# EAGLE design schema Light_system (EAGLE 9.2.0)
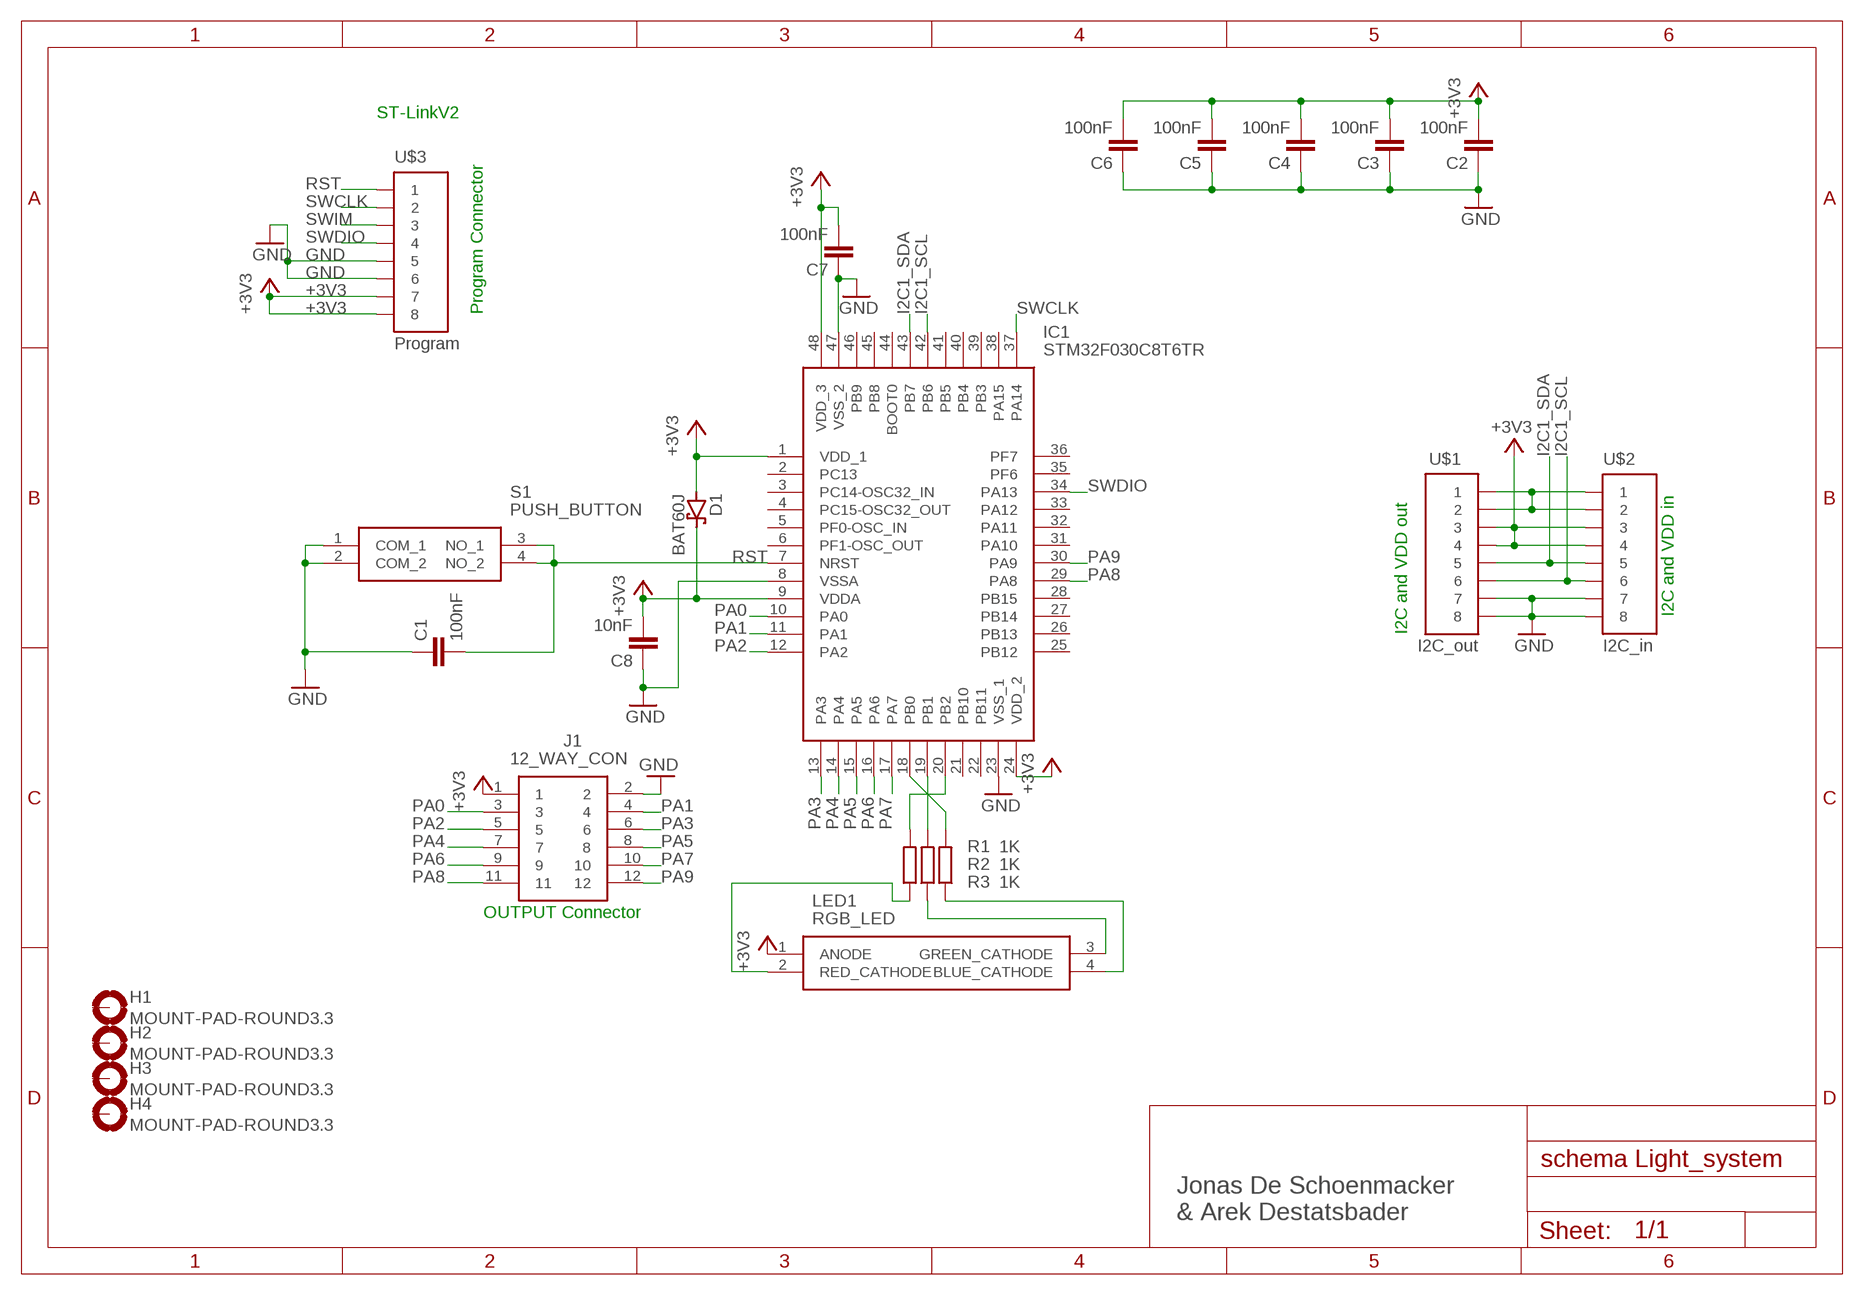
[diagram p0: schematic, sheet 1]

## Parts
C1  100nF  C-EUC1206  [C1206]
C2  100nF  C-EUC1206  [C1206]
C3  100nF  C-EUC1206  [C1206]
C4  100nF  C-EUC1206  [C1206]
C5  100nF  C-EUC1206  [C1206]
C6  100nF  C-EUC1206  [C1206]
C7  100nF  C-EUC1206  [C1206]
C8  10nF  C-EUC1206  [C1206]
D1  BAT60J  [SOD323_ST]
H1  MOUNT-PAD-ROUND3.3  [3,3-PAD]
H2  MOUNT-PAD-ROUND3.3  [3,3-PAD]
H3  MOUNT-PAD-ROUND3.3  [3,3-PAD]
H4  MOUNT-PAD-ROUND3.3  [3,3-PAD]
IC1  STM32F030C8T6TR  [QFP50P900X900X160-48N]
J1  12_WAY_CON  [1990106]
LED1  RGB_LED  [ASMBKTF00A306]
R1  1K  R-EU_R1206  [R1206]
R2  1K  R-EU_R1206  [R1206]
R3  1K  R-EU_R1206  [R1206]
S1  PUSH_BUTTON  [LL3301FF065QJ]
U$1  I2C_out  MODULARCONNECTOR  [MA04-2]
U$2  I2C_in  MODULARCONNECTOR  [MA04-2]
U$3  Program  MODULARCONNECTOR  [MA04-2]

## Nets
+3V3: C2.2 C3.2 C4.2 C5.2 C6.2 C7.2 C8.2 D1.A D1.C IC1.1(VDD_1) IC1.9(VDDA) IC1.24(VDD_2) IC1.48(VDD_3) J1.1 LED1.1(ANODE) U$1.3 U$1.4 U$2.3 U$2.4 U$3.7 U$3.8
GND: C1.1 C2.1 C3.1 C4.1 C5.1 C6.1 C7.1 C8.1 IC1.8(VSSA) IC1.23(VSS_1) IC1.47(VSS_2) J1.2 S1.1(COM_1) S1.2(COM_2) U$1.7 U$1.8 U$2.7 U$2.8 U$3.5 U$3.6
I2C1_SCL: IC1.42(PB6) U$1.6 U$2.6
I2C1_SDA: IC1.43(PB7) U$1.5 U$2.5
N$1: LED1.2(RED_CATHODE) R1.1
N$2: LED1.3(GREEN_CATHODE) R2.1
N$3: IC1.20(PB2) R1.2
N$4: LED1.4(BLUE_CATHODE) R3.1
N$5: U$1.1 U$1.2 U$2.1 U$2.2
N$6: IC1.19(PB1) R2.2
N$7: IC1.18(PB0) R3.2
PA0: IC1.10(PA0) J1.3
PA1: IC1.11(PA1) J1.4
PA2: IC1.12(PA2) J1.5
PA3: IC1.13(PA3) J1.6
PA4: IC1.14(PA4) J1.7
PA5: IC1.15(PA5) J1.8
PA6: IC1.16(PA6) J1.9
PA7: IC1.17(PA7) J1.10
PA8: IC1.29(PA8) J1.11
PA9: IC1.30(PA9) J1.12
RST: C1.2 IC1.7(NRST) S1.3(NO_1) S1.4(NO_2) U$3.1
SWCLK: IC1.37(PA14) U$3.2
SWDIO: IC1.34(PA13) U$3.4
SWIM: U$3.3
Unconnected: H1.B3,3(MOUNT) H2.B3,3(MOUNT) H3.B3,3(MOUNT) H4.B3,3(MOUNT) IC1.2(PC13) IC1.3(PC14-OSC32_IN) IC1.4(PC15-OSC32_OUT) IC1.5(PF0-OSC_IN) IC1.6(PF1-OSC_OUT) IC1.21(PB10) IC1.22(PB11) IC1.25(PB12) IC1.26(PB13) IC1.27(PB14) IC1.28(PB15) IC1.31(PA10) IC1.32(PA11) IC1.33(PA12) IC1.35(PF6) IC1.36(PF7) IC1.38(PA15) IC1.39(PB3) IC1.40(PB4) IC1.41(PB5) IC1.44(BOOT0) IC1.45(PB8) IC1.46(PB9)

## Notes on the sheet
- ST-LinkV2
- Program Connector
- I2C and VDD in
- I2C and VDD out
- OUTPUT Connector
- Jonas De Schoenmacker
  & Arek Destatsbader

## Library data of the parts
C1-C8 = resistor:C-EU: CAPACITOR, European symbol
D1 = diode:BAT60J: Schottky barrier diode Source: www.st.com, BAT60J.pdf
H1-H4 = holes:MOUNT-PAD-ROUND: MOUNTING PAD, round
IC1 = Library light system:STM32F030C8T6TR: 32-Bit MCU Cortex-M0 64K Flash LQFP48 32-Bit MCU Cortex-M0 64K Flash LQFP48 Source: Datasheet <https://componentsearchengine.com/Datasheets/1/STM32F030C8T6TR.pdf>; DESCRIPTION: 32-Bit MCU Cortex-M0 64K Flash LQFP48 32-Bit MCU Cortex-M0 64K Flash LQFP48; HEIGHT: 1.6mm; MANUFACTURER_NAME: STMicroelectronics; MANUFACTURER_PART_NUMBER: STM32F030C8T6TR; MOUSER_PART_NUMBER: 511-STM32F030C8T6TR; MOUSER_PRICE-STOCK: https://www.mouser.com/Search/Refine.aspx?Keyword=511-STM32F030C8T6TR
J1 = Library light system:12_WAY_CON: PTSA 0,5/12-2,5-Z Source: Datasheet <https://componentsearchengine.com/Datasheets/1/1990106.pdf>; DESCRIPTION: PTSA 0,5/12-2,5-Z; HEIGHT: 13.1mm; MANUFACTURER_NAME: Phoenix Contact; MANUFACTURER_PART_NUMBER: 1990106; MOUSER_PART_NUMBER: 651-1990106; MOUSER_PRICE-STOCK: https://www.mouser.com/Search/Refine.aspx?Keyword=651-1990106
LED1 = Library light system:RGB_LED: Standard LEDs - SMD 2220 PLCC4 Tricolor Source: Datasheet <https://componentsearchengine.com/Datasheets/1/ASMB-KTF0-0A306.pdf>; DESCRIPTION: Standard LEDs - SMD 2220 PLCC4 Tricolor; HEIGHT: 2.1mm; MANUFACTURER_NAME: Avago Technologies; MANUFACTURER_PART_NUMBER: ASMB-KTF0-0A306; MOUSER_PART_NUMBER: 630-ASMB-KTF0-0A306; MOUSER_PRICE-STOCK: https://www.mouser.com/Search/Refine.aspx?Keyword=630-ASMB-KTF0-0A306
R1-R3 = rcl:R-EU_: RESISTOR, European symbol; SPICEPREFIX: R
S1 = Library light system:PUSH_BUTTON: Pushbutton Switches 50mA 12VDC F065 7.0mm J-Lead Source: Datasheet <https://componentsearchengine.com/Datasheets/1/LL3301FF065QJ.pdf>; DESCRIPTION: Pushbutton Switches 50mA 12VDC F065 7.0mm J-Lead; HEIGHT: 7.3mm; MANUFACTURER_NAME: E-Switch; MANUFACTURER_PART_NUMBER: LL3301FF065QJ; MOUSER_PART_NUMBER: 612-LL3301FF065QJ; MOUSER_PRICE-STOCK: https://www.mouser.com/Search/Refine.aspx?Keyword=612-LL3301FF065QJ
U$1-U$3 = Main_lib:MODULARCONNECTOR

## Net classes
1 OSC pairs: width 0.305 mm

## Board
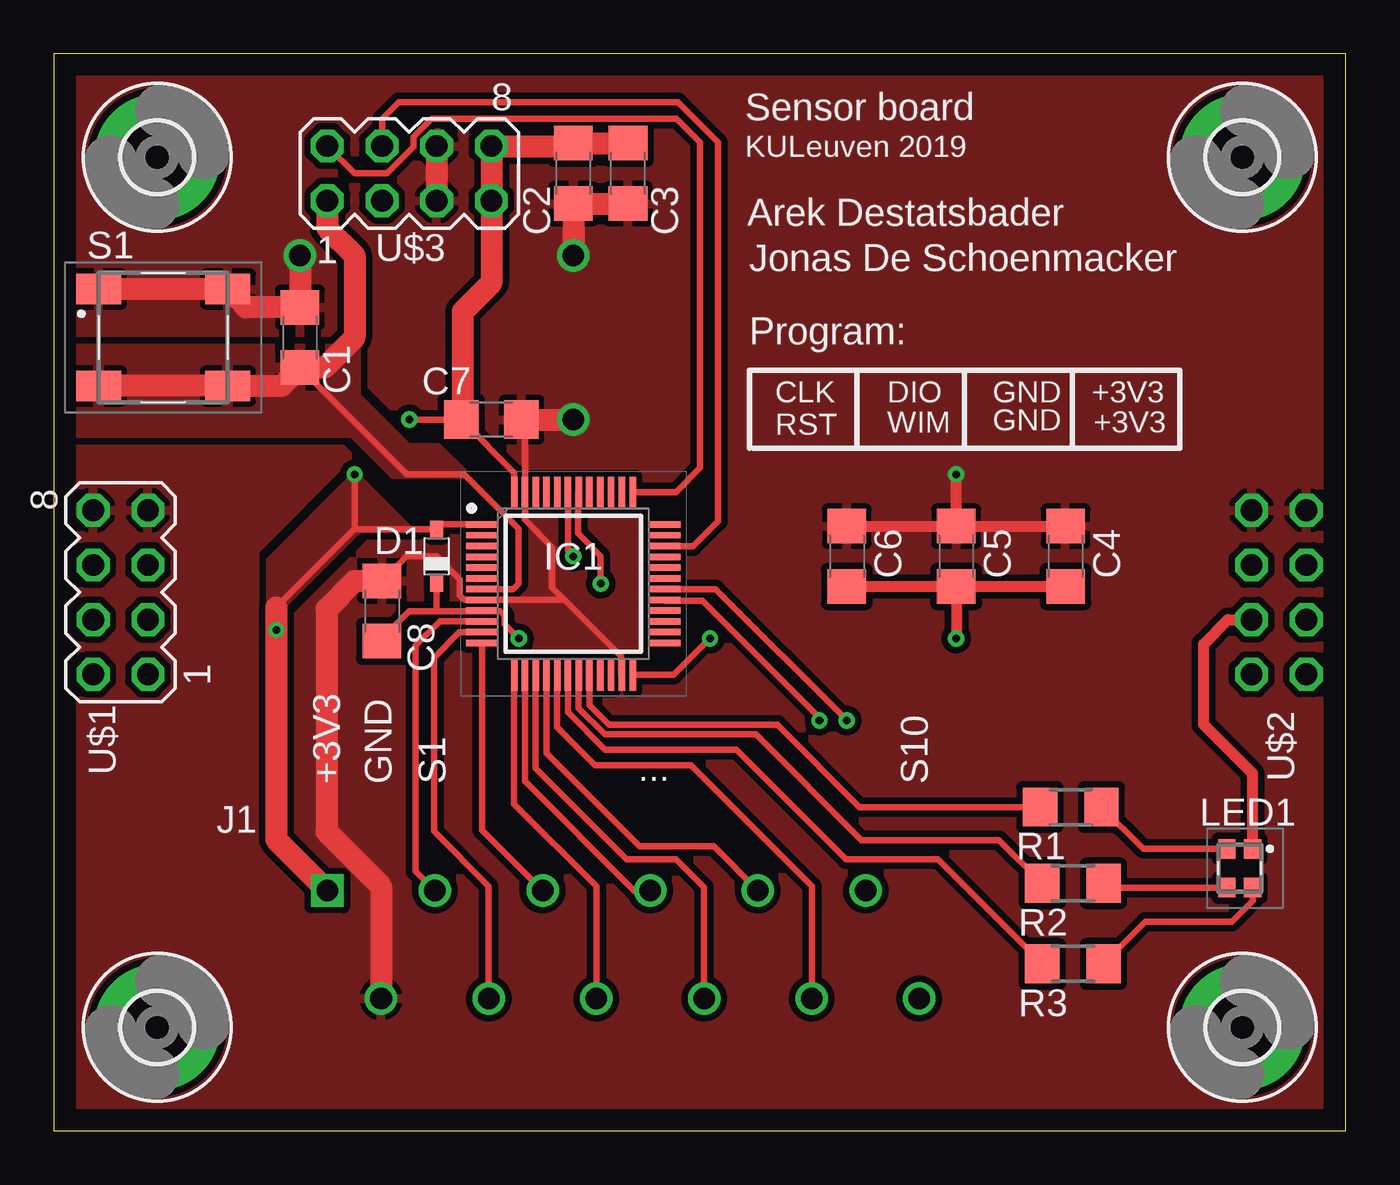
[diagram p1: board, top side]
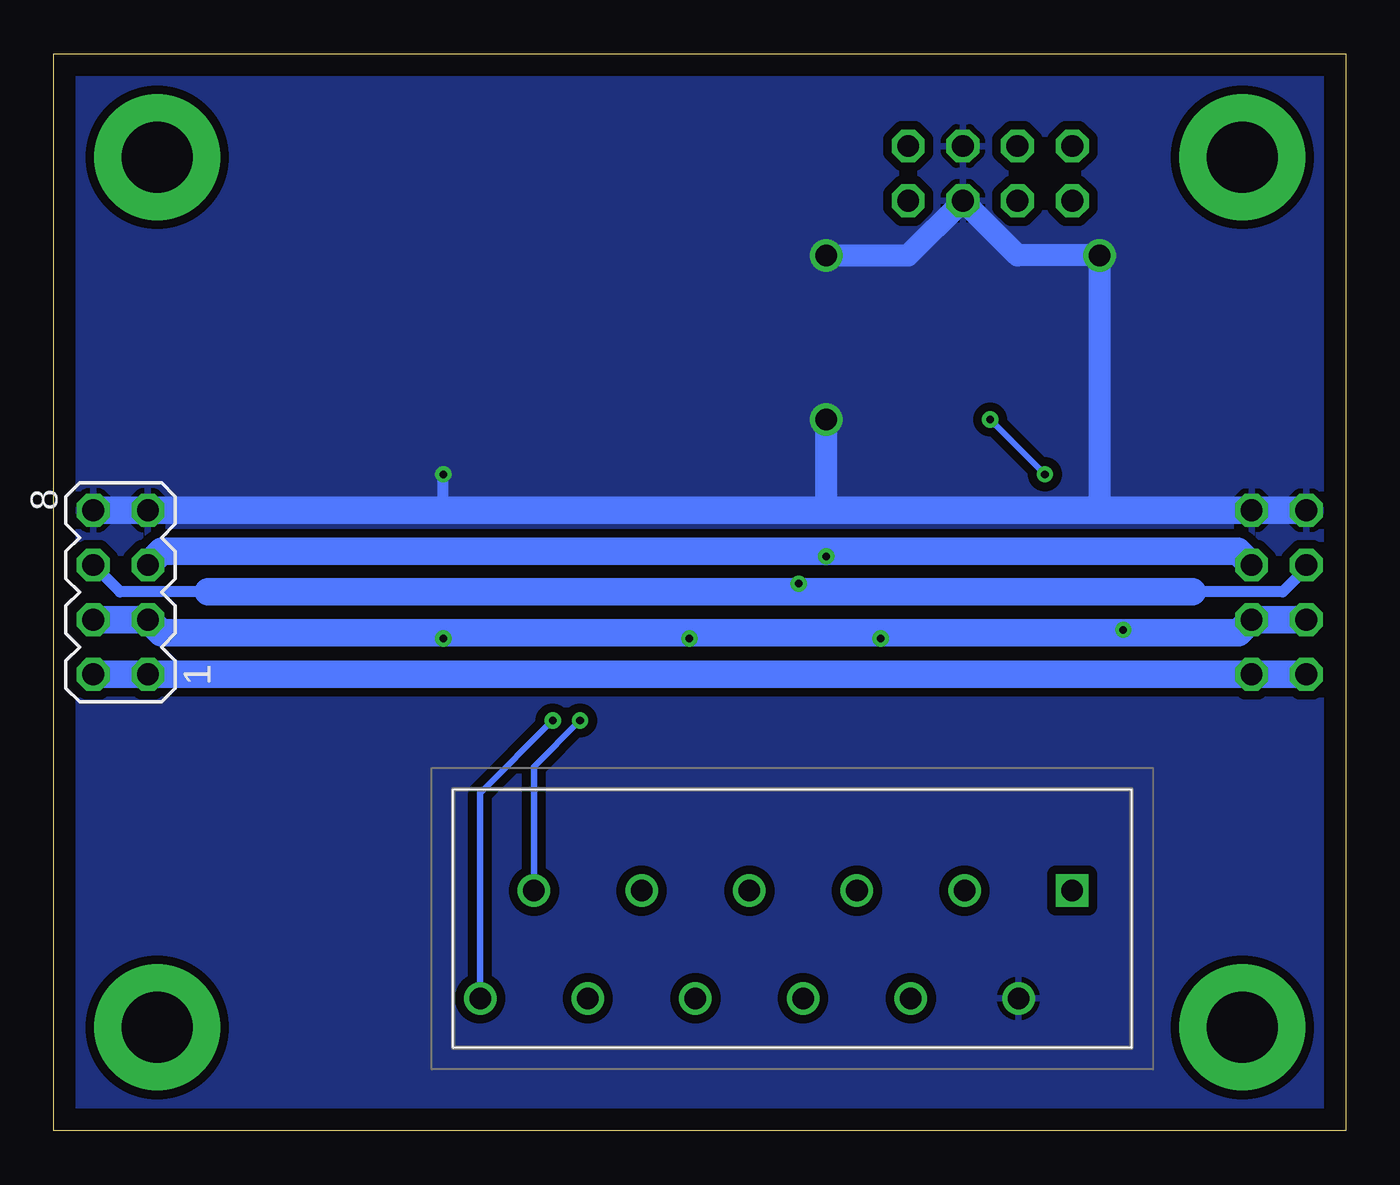
[diagram p2: board, bottom side, seen from below]

Size 60 x 50 mm. Coordinates in mm from the lower left corner, seen from the top.
Outline: 0,0 60,0 60,50 0,50 0,0
Copper layers (1*16): Top 0.035mm / dielectric 1.5mm / Bottom 0.035mm
Design rules "default": minimum track width 6mil, minimum drill 0.35mm, track to track 6mil, track to pad 6mil, pad to pad 6mil, via to via 6mil, smd to smd 6mil, copper to edge 40mil, drill to drill 6mil, minimum pad ring 10mil, minimum via ring 8mil, stop-mask expansion 4mil, vias tented up to drill 0mil, thermal gap 10mil

### Footprints (pad centres in the part's own frame; a part is rotated, then mirrored left to right if it is on the bottom)
C1206 = smd 1.6 x 1.8: 1 -1.4,0; 2 1.4,0
SOD323_ST = smd 0.8 x 0.6: A 1.25,0; C -1.25,0
3,3-PAD = drill 3.3 pad 5.842: B3,3 0,0
QFP50P900X900X160-48N = smd 1.475 x 0.3: 1 -4.238,2.75; 2 -4.238,2.25; 3 -4.238,1.75; 4 -4.238,1.25; 5 -4.238,0.75; 6 -4.238,0.25; 7 -4.238,-0.25; 8 -4.238,-0.75; 9 -4.238,-1.25; 10 -4.238,-1.75; 11 -4.238,-2.25; 12 -4.238,-2.75; 25 4.238,-2.75; 26 4.238,-2.25; 27 4.238,-1.75; 28 4.238,-1.25; 29 4.238,-0.75; 30 4.238,-0.25; 31 4.238,0.25; 32 4.238,0.75; 33 4.238,1.25; 34 4.238,1.75; 35 4.238,2.25; 36 4.238,2.75 | smd 0.3 x 1.475: 13 -2.75,-4.238; 14 -2.25,-4.238; 15 -1.75,-4.238; 16 -1.25,-4.238; 17 -0.75,-4.238; 18 -0.25,-4.238; 19 0.25,-4.238; 20 0.75,-4.238; 21 1.25,-4.238; 22 1.75,-4.238; 23 2.25,-4.238; 24 2.75,-4.238; 37 2.75,4.238; 38 2.25,4.238; 39 1.75,4.238; 40 1.25,4.238; 41 0.75,4.238; 42 0.25,4.238; 43 -0.25,4.238; 44 -0.75,4.238; 45 -1.25,4.238; 46 -1.75,4.238; 47 -2.25,4.238; 48 -2.75,4.238
1990106 = drill 1 pad 1.5 square: 1 0,0 | drill 1 pad 1.5: 2 2.5,5; 3 5,0; 4 7.5,5; 5 10,0; 6 12.5,5; 7 15,0; 8 17.5,5; 9 20,0; 10 22.5,5; 11 25,0; 12 27.5,5
ASMBKTF00A306 = smd 0.9 x 0.8: 1 0.9,-0.6; 2 0.9,0.6; 3 -0.9,0.6; 4 -0.9,-0.6
R1206 = smd 1.6 x 1.803: 1 -1.422,0; 2 1.422,0
LL3301FF065QJ = smd 2.1 x 1.4: 1 -3,2.25; 2 3,2.25; 3 -3,-2.25; 4 3,-2.25
MA04-2 = drill 1.016 octagon: 1 -3.81,-1.27; 2 -3.81,1.27; 3 -1.27,-1.27; 4 -1.27,1.27; 5 1.27,-1.27; 6 1.27,1.27; 7 3.81,-1.27; 8 3.81,1.27

### Placement (x,y rotation side)
C1  11.43,36.83 270 top
C2  24.13,44.45 90 top
C3  26.67,44.45 90 top
C4  46.99,26.67 270 top
C5  41.91,26.67 270 top
C6  36.83,26.67 270 top
C7  20.32,33.02 180 top
C8  15.24,24.13 270 top
D1  17.78,26.67 90 top
H1  4.8,45.2 0 top
H2  55.2,45.2 0 top
H3  4.8,4.8 0 top
H4  55.2,4.8 0 top
IC1  24.13,25.4 0 top
J1  12.7,11.15 180 bottom
LED1  55.08,12.19 90 top
R1  47.23,15.03 180 top
R2  47.33,11.49 180 top
R3  47.33,7.75 180 top
S1  5.08,36.83 0 top
U$1  3.1,25 90 top
U$2  56.9,25 90 bottom
U$3  16.51,44.45 0 top

### Tracks (layer width: path | path; a pad name or v marks a point on that pad's centre or on a via)
+3V3  (via drill 0.35)
  Top 0.152: IC1.9 19.87,24.13 | 15.24,22.86 C8.2 | 13.97,27.94 13.95,27.92
  Top 0.305: IC1.48 21.38,30.56 18.98,32.95 C7.2 v16.51,33.02 | 17.78,24.13 19.87,24.13 20.73,24.13 20.93,23.93 20.93,23.52 v21.59,22.86 | 17.78,24.13 16.51,24.13 15.24,22.86 | 10.33,24.3 13.95,27.92 D1.A 18.01,28.15 IC1.1 | D1.C 17.78,24.13 | v30.48,22.86 28.78,21.16 IC1.24 | v13.97,30.48 13.97,27.94
  Top 0.508: C5.2 v41.91,22.86 | C6.2 C5.2 | C5.2 C4.2 | LED1.1 55.68,16.58 53.4,18.86 53.4,22.6 54.53,23.73 U$2.3
  Top 1.016: 10.33,24.3 v10.33,23.26 10.33,13.52 J1.1 | C3.2 C2.2 24,45.72 U$3.8 U$3.7 20.32,39.37 18.98,38.03 18.98,32.95
  Bottom 0.152: v10.33,23.26 10.18,23.11 8.89,23.11
  Bottom 0.305: v41.91,22.86 42.16,23.11 43.18,23.11 | v30.48,22.86 30.48,23.11 | v21.59,22.86 21.84,23.11 22.86,23.11 | v13.97,30.48 v16.51,33.02
  Bottom 1.27: U$2.4 U$2.3 55.01,23.11 43.18,23.11 30.48,23.11 22.86,23.11 8.89,23.11 4.99,23.11 U$1.3 U$1.4
  pour Top: 14,30.5 16.6,27.9 14.2,27.9 10,23.7 10,26.5
GND  (via drill 0.35, 1)
  Top 0.152: 21.88,32.86 C7.1
  Top 0.305: 21.88,32.86 IC1.47 21.88,28.37 23.15,27.1 23.15,25.21 23.71,24.65 | C8.1 16.38,26.67 17.78,26.67 18.85,25.6 18.85,24.87 19.07,24.65 IC1.8 23.71,24.65 | IC1.23 26.34,21.21 26.34,22.03 23.71,24.65
  Top 0.508: C5.1 v41.91,30.48 | C6.1 C5.1 | C5.1 C4.1
  Top 1.016: U$3.6 U$3.5 | S1.1 S1.2 8.93,38.23 C1.1 v11.43,40.64 | C8.1 13.97,25.53 12.66,24.22 12.66,13.89 15.2,11.35 J1.2 | v24.13,40.64 C2.1 C3.1 | C7.1 v24.13,33.02
  Bottom 0.508: 41.91,28.81 v41.91,30.48
  Bottom 1.016: 11.43,28.81 v11.43,40.64 15.24,40.64 U$3.5 20.32,40.64 v24.13,40.64 | v24.13,33.02 24.13,28.81
  Bottom 1.27: U$2.8 U$2.7 41.91,28.81 24.13,28.81 11.43,28.81 U$1.7 U$1.8
  pour Bottom (isolate 0.406): -0.03,49.93 60.09,49.93 60.09,-0.06 -0.03,-0.06
  pour Top (isolate 0.305, rank 6): -0.03,49.93 60.09,49.93 60.09,-0.03 -0.03,-0.03
I2C1_SCL  (via drill 0.35)
  Top 0.305: v25.4,25.4 25.4,26.67 24.34,27.73 24.34,29.59 IC1.42
  Bottom 0.305: v25.4,25.4 25.4,25.02
  Bottom 0.508: U$1.6 1.83,26.11 2.92,25.02 7.11,25.02 | 52.83,25.02 56.92,25.02 U$2.6
  Bottom 1.27: 7.11,25.02 25.4,25.02 52.83,25.02
I2C1_SDA  (via drill 0.35)
  Top 0.305: v24.13,26.67 23.88,26.92 23.88,29.21 IC1.43
  Bottom 0.305: v24.13,26.67 24.13,26.91
  Bottom 1.27: U$2.5 54.99,26.91 24.13,26.91 5,26.91 U$1.5
N$1
  Top 0.305: R1.1 50.59,13.09 LED1.2
N$2
  Top 0.305: R2.1 48.95,11.29 LED1.3
N$3
  Top 0.305: IC1.20 24.88,19.77 25.79,18.86 33.6,18.86 37.43,15.03 R1.2
N$4
  Top 0.305: R3.1 50.7,9.7 54.7,9.7 55.68,10.68 LED1.4
N$5
  Bottom 1.27: U$1.2 U$1.1 U$2.1 U$2.2
N$6
  Top 0.305: R2.2 43.9,13.5 37.5,13.5 32.6,18.4 25.6,18.4 24.38,19.62 IC1.19
N$7
  Top 0.305: IC1.18 23.88,19.42 25.6,17.7 31.7,17.7 36.8,12.6 41.06,12.6 R3.2
PA0
  Top 0.305: IC1.10 17.93,23.65 16.81,22.53 16.81,12.04 J1.3
PA1
  Top 0.305: IC1.11 18.83,23.15 17.65,21.97 17.65,13.9 20.2,11.35 J1.4
PA2
  Top 0.305: J1.5 19.89,13.96 IC1.12
PA3
  Top 0.305: IC1.13 21.38,15.17 25.2,11.35 J1.6
PA4
  Top 0.305: IC1.14 21.88,16.22 26.95,11.15 J1.7
PA5
  Top 0.305: IC1.15 22.38,16.82 26.6,12.6 28.9,12.6 30.2,11.3 J1.8
PA6
  Top 0.305: J1.9 30.65,13.2 27.2,13.2 22.88,17.52 IC1.16
PA7
  Top 0.305: IC1.17 23.38,18.73 25.15,16.97 29.58,16.97 35.2,11.35 J1.10
PA8  (via drill 0.35)
  Top 0.305: IC1.29 28.41,24.61 30.13,24.61 35.56,19.18 v35.56,19.05
  Bottom 0.305: v35.56,19.05 37.7,16.91 J1.11
PA9  (via drill 0.35)
  Top 0.305: IC1.30 30.73,25.15 v36.83,19.05
  Bottom 0.305: v36.83,19.05 40.2,15.68 J1.12
RST
  Top 0.305: IC1.7 21.34,25.15 21.59,25.4 21.59,27.94 19.05,30.48 16.38,30.48 C1.2
  Top 1.016: S1.3 S1.4 10.58,34.58 C1.2 12.57,35.43 13.97,36.83 13.97,40.64 12.7,41.91 U$3.1
  pour Top: 14,37 14,34.1 16.4,31.7 17.8,31.7 19,30.5 15.8,30.5 13.9,32.4 0.2,32.4 0.2,36.3 13.3,36.3
SWCLK
  Top 0.305: U$3.2 13.97,44.45 15.48,44.45 16.71,45.69 16.71,46.16 17.54,46.99 28.93,46.99 30.02,45.9 30.02,30.77 28.89,29.64 IC1.37
SWDIO
  Top 0.305: IC1.34 29.69,27.15 30.85,28.31 30.85,45.89 28.98,47.76 16.01,47.76 15.24,46.99 U$3.4

### Text on the board
tNames: Sensor board | KULeuven 2019 | Arek Destatsbader | Jonas De Schoenmacker | Program: | CLK | DIO | GND | +3V3 | RST | WIM | GND | +3V3 | ... | +3V3 | GND | S1 | S10